# Altium schematic sheet Motor.SchDoc
size A4
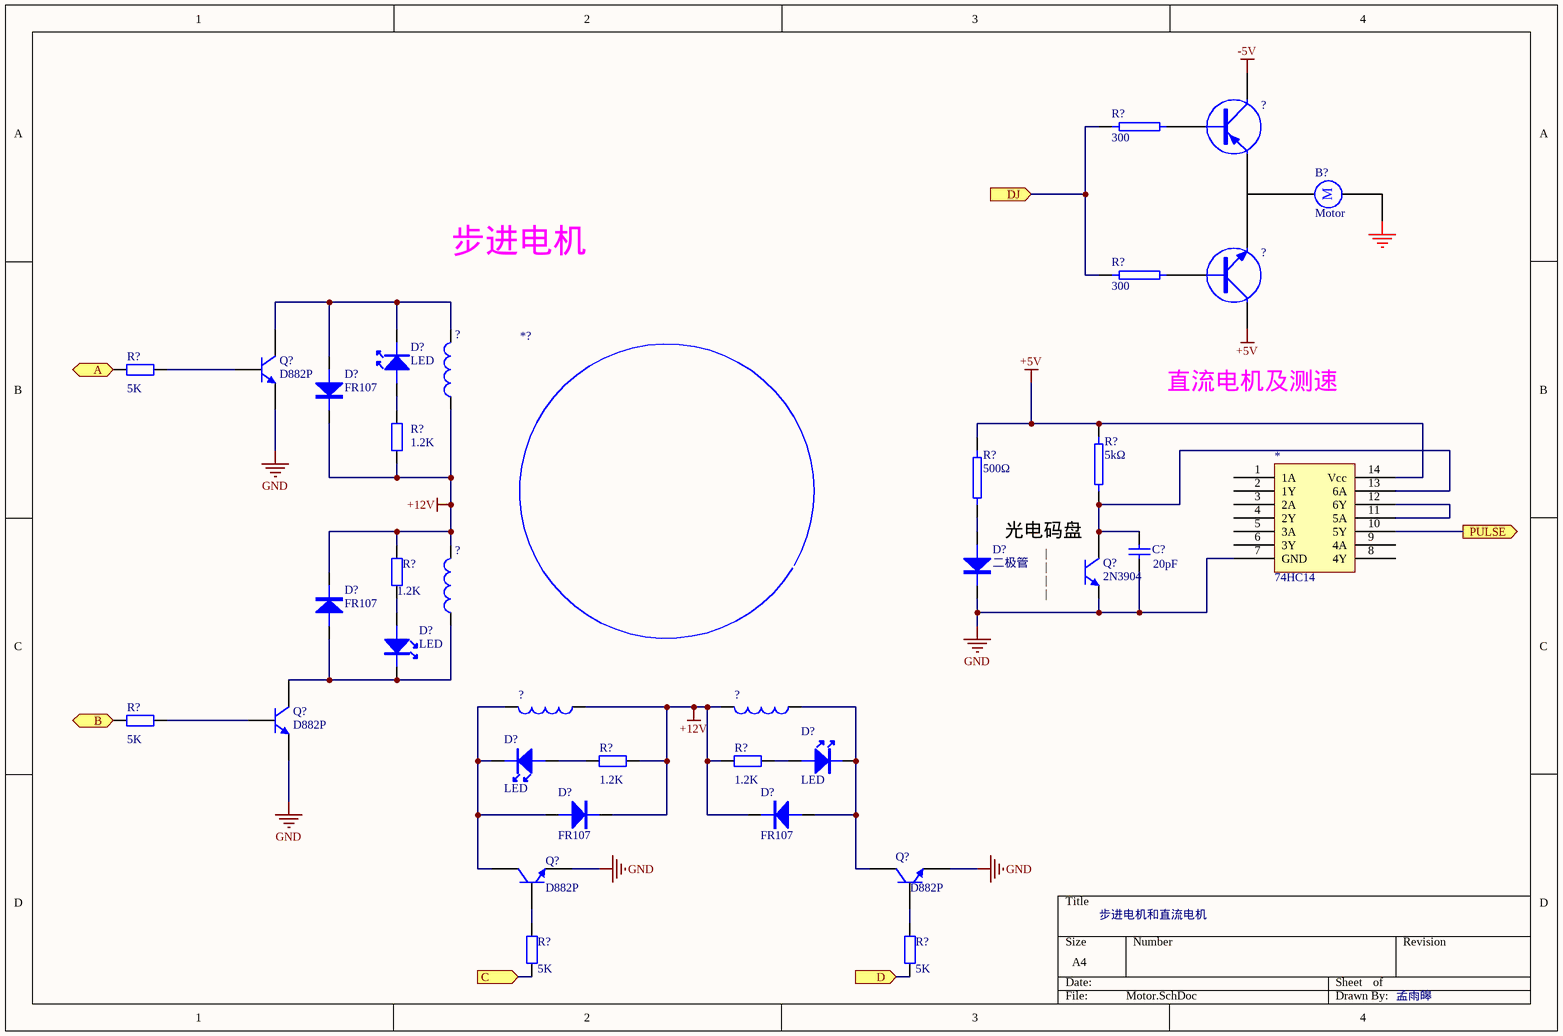
[diagram p0: Motor.SchDoc]

## Parts
(Parts that share a designator on the sheet are numbered #1, #2 ... from top to bottom, then left to right.)
*  74HC14
*?  bujindianji  (value not drawn)
?#1  (no value)
?#2  (no value)
?#3  Inductor  [INDC1005AL]  (value not drawn)
?#4  Inductor  [INDC1005AL]  (value not drawn)
?#5  (no value)  [INDC1005AL]
?#6  Inductor  [INDC1005AL]  (value not drawn)
B?  Motor  [RB5-10.5]
C?  value 20pF  [RAD-0.3]
D?#1  LED
D?#2  FR107
D?#3  FR107
D?#4  二极管
D?#5  LED
D?#6  LED
D?#7  LED
D?#8  FR107
D?#9  FR107
Q?#1  D882P  [sot-23]
Q?#2  2N3904  [BCY-W3/E4]
Q?#3  D882P  [sot-23]
Q?#4  D882P  [sot-23]
Q?#5  D882P  [sot-23]
R?#1  300
R?#2  300
R?#3  value 5K  [AXIAL-0.4]
R?#4  value 1.2K  [AXIAL-0.4]
R?#5  5kΩ
R?#6  500Ω
R?#7  value 1.2K  [AXIAL-0.4]
R?#8  value 5K  [AXIAL-0.4]
R?#9  value 1.2K  [AXIAL-0.4]
R?#10  value 1.2K  [AXIAL-0.4]
R?#11  value 5K  [AXIAL-0.4]
R?#12  value 5K  [AXIAL-0.4]

## Ports
A (in), B (in), C (in), D (in), DJ (in), PULSE (out)

## Nets
+5V: *.14(Vcc) ?#2.2(C) R?#5.2 R?#6.2
+12V: ?#3.1 ?#4.2 ?#5.1 ?#6.2 D?#2.K D?#3.K D?#8.K D?#9.K R?#4.1 R?#7.1 R?#9.1 R?#10.1
-5V: ?#1.3(C)
GND: *.7(GND) C?.1 D?#4.K Q?#1.2(E) Q?#2.1(E) Q?#3.2(E) Q?#4.2(E) Q?#5.2(E)
A: R?#3.1 ; port A
B: R?#8.1 ; port B
C: R?#11.1 ; port C
D: R?#12.1 ; port D
DJ: R?#1.1 R?#2.1 ; port DJ
PULSE: *.10(5Y) ; port PULSE
Net*_11: *.11(5A) *.12(6Y)
Net*_13: *.13(6A) C?.2 Q?#2.3(C) R?#5.1
Net?#1_1: ?#1.1(B) R?#1.2
Net?#2_1: ?#2.1(B) R?#2.2
Net?#3_2: ?#3.2 D?#1.2 D?#2.A Q?#1.3(C)
Net?#4_1: ?#4.1 D?#3.A D?#5.2 Q?#3.3(C)
Net?#5_2: ?#5.2 D?#6.2 D?#8.A Q?#4.3(C)
Net?#6_1: ?#6.1 D?#7.2 D?#9.A Q?#5.3(C)
NetD?#1_1: D?#1.1 R?#4.2
NetD?#4_A: D?#4.A R?#6.1
NetD?#5_1: D?#5.1 R?#7.2
NetD?#6_1: D?#6.1 R?#10.2
NetD?#7_1: D?#7.1 R?#9.2
NetQ?#1_1: Q?#1.1(B) R?#3.2
NetQ?#3_1: Q?#3.1(B) R?#8.2
NetQ?#4_1: Q?#4.1(B) R?#11.2
NetQ?#5_1: Q?#5.1(B) R?#12.2

Not connected (* = marked no-connect by the designer): * 1(1A) 2(1Y) 3(2A) 4(2Y) 5(3A) 6(3Y) 8(4Y) 9(4A); ?#1 2(E); ?#2 3(E); B? 1 2

## Notes on the sheet
- 步进电机
- 直流电机及测速
- (near Q?#2) 光电码盘
- (near Q?#2) |
  |
  |
  |
- 步进电机和直流电机
- 孟雨皞
- Labels drawn without touching a wire or pin: GND
- (in symbol bujindianji) 步进电机
- (in symbol Motor) M

## Library data of the parts
?#1 = PNP: PNP Transistor
?#2 = NPN: NPN Transistor
?#3-?#6 = Inductor: Code_IEC: 1005; Value: 10mH; Published: 8-Jun-2000; LatestRevisionDate: 29-May-2009; LatestRevisionNote: IPC-7351 Footprint Added.; PackageReference: 0402-A; Publisher: Altium Limited; PackageDescription: Chip Inductor; Code_JEITA: 0402
B? = Motor: Motor, General Kind; Published: 24-Mar-1999; LatestRevisionDate: 17-Jul-2002; LatestRevisionNote: Re-released for DXP Platform.; PackageReference: RB5-10.5; Publisher: Altium Limited; PackageDescription: Capacitor (Radial); 2 Leads
C? = Cap: Capacitor; Published: 8-Jun-2000; LatestRevisionDate: 17-Jul-2002; LatestRevisionNote: Re-released for DXP Platform.; PackageReference: RAD-0.3; Publisher: Altium Limited
D?#2 D?#3 D?#8 D?#9 = 二极管
Q?#1-Q?#5 = 2N3904: NPN General Purpose Amplifier; Published: 8-Jun-2000; LatestRevisionDate: 15-Jan-2003; LatestRevisionNote: PCB Footprint 'BCY-W3/D4.7' replaced; PackageReference: TO-92A; Publisher: Altium Limited; Code_JEDEC: TO-92A; ComponentLink1Description: Manufacturer Link; ComponentLink1URL: http://www.fairchildsemi.com/; ComponentLink2Description: Datasheet; ComponentLink2URL: http://www.fairchildsemi.com/ds/2N%2F2N3904.pdf
  Q?#1 Q?#3-Q?#5: DatasheetDocument: 1997; PackageDocument: Sep-1998
  Q?#2: DatasheetVersion: 1997; PackageVersion: Sep-1998
R?#1 R?#2 R?#5 R?#6 = 电阻
R?#3 R?#4 R?#7-R?#12 = Res2: Resistor; Published: 8-Jun-2000; LatestRevisionDate: 17-Jul-2002; LatestRevisionNote: Re-released for DXP Platform.; PackageReference: AXIAL-0.4; Publisher: Altium Limited